# EAGLE design THC-schematicRevES (EAGLE 6.4)
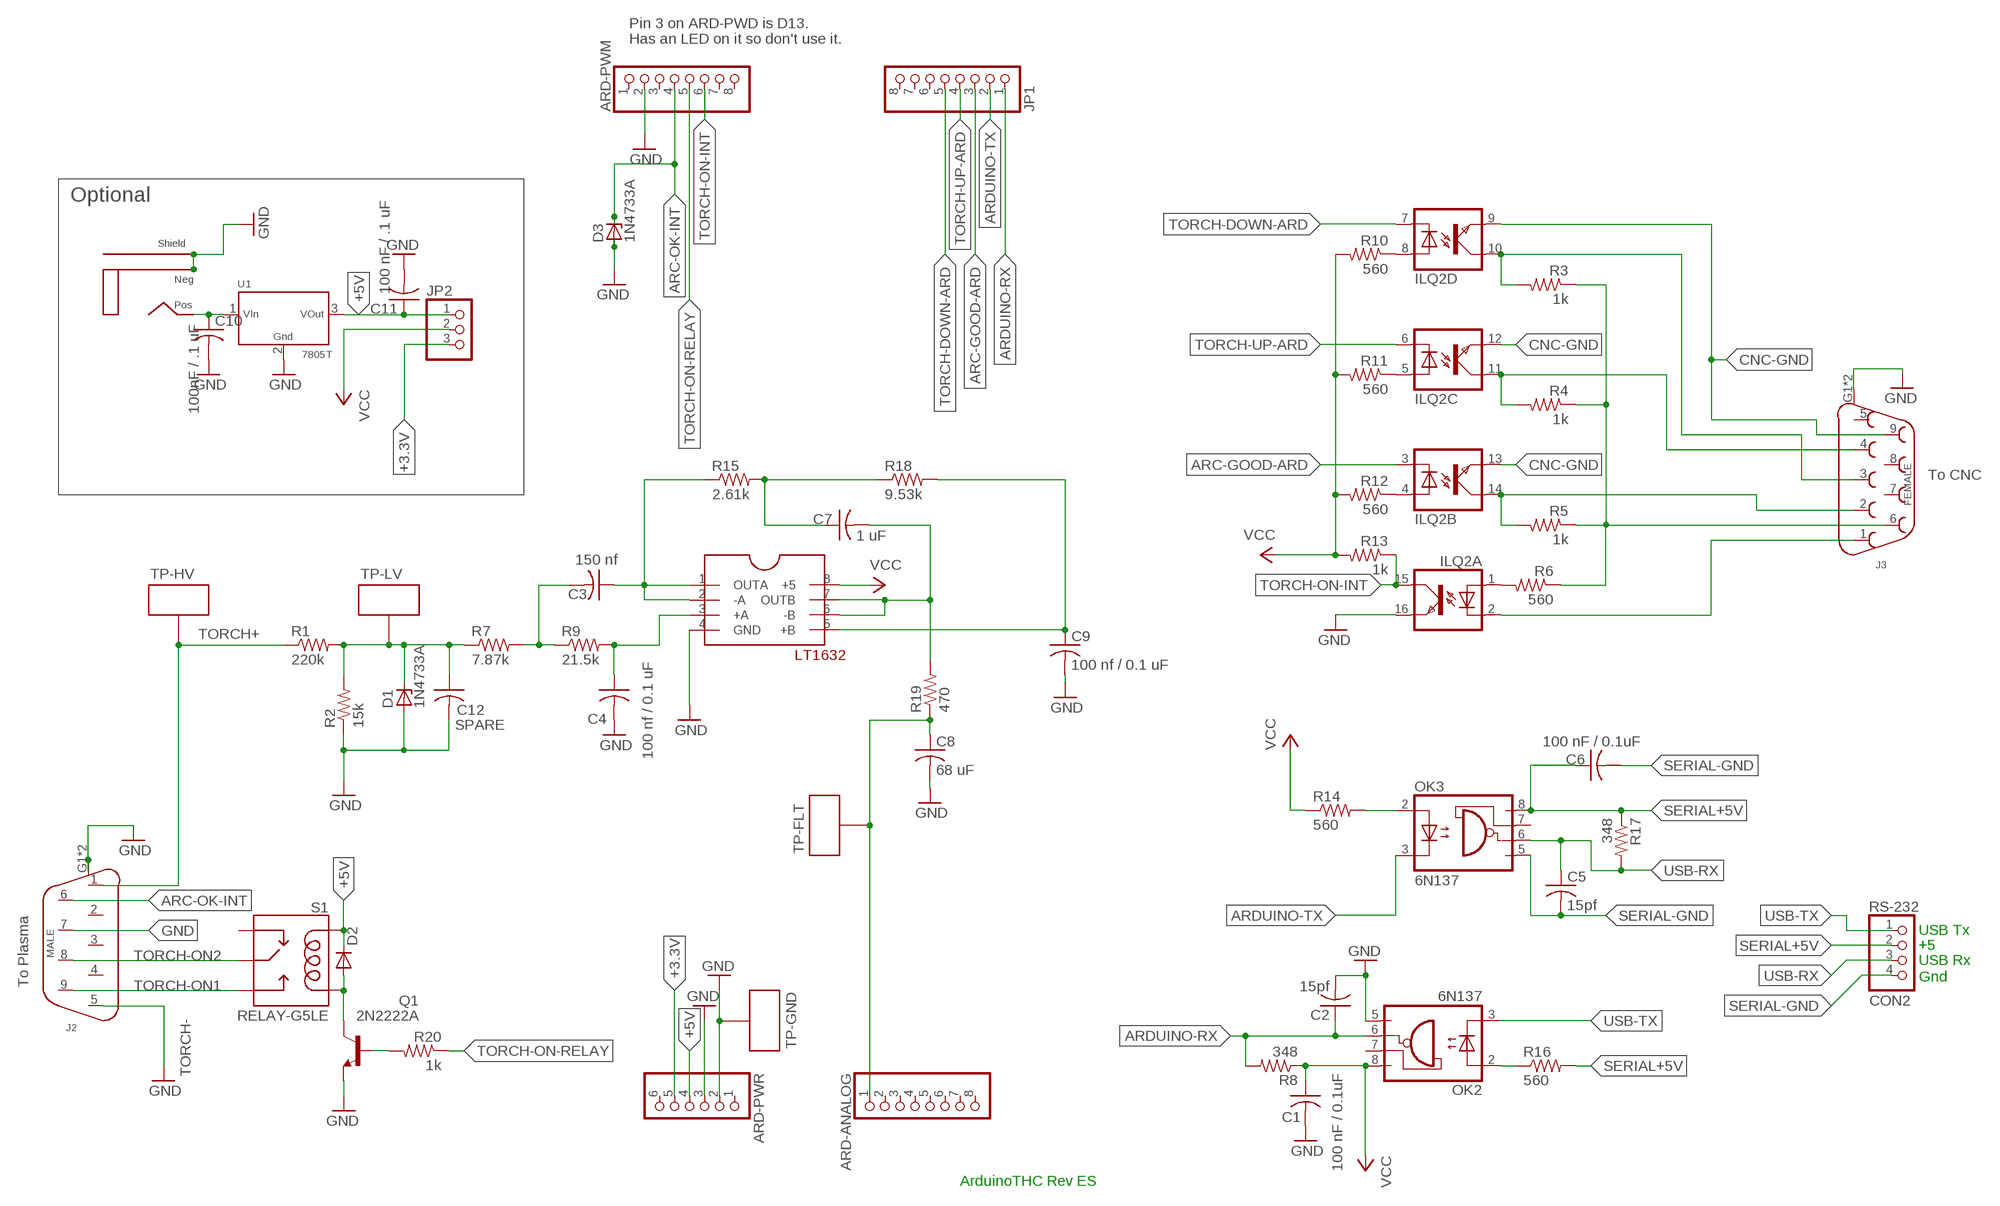
[diagram p0: schematic, sheet 1]

## Parts
ARD-ANALOG  PINHD-1X8  [1X08]
ARD-PWM  PINHD-1X8  [1X08]
ARD-PWR  PINHD-1X6  [1X06]
C1  100 nF / 0.1uF  C-US025-025X050  [C025-025X050]
C2  15pf  C-US025-025X050  [C025-025X050]
C3  150 nf  C-US025-025X050  [C025-025X050]
C4  100 nf / 0.1 uF  C-US025-025X050  [C025-025X050]
C5  15pf  C-US025-025X050  [C025-025X050]
C6  100 nF / 0.1uF  C-US025-025X050  [C025-025X050]
C7  1 uF  C-US025-025X050  [C025-025X050]
C8  68 uF  C-US025-025X050  [C025-025X050]
C9  100 nf / 0.1 uF  C-US025-025X050  [C025-025X050]
C10  100nF / .1 uF  C-US025-025X050  [C025-025X050]
C11  100 nF / .1 uF  C-US025-025X050  [C025-025X050]
C12  SPARE  C-US025-025X050  [C025-025X050]
D1  1N4733A  ZPY  [DO41Z10]
D2  1N4001  [DO-204AL]
D3  1N4733A  ZPY  [DO41Z10]
ILQ2  ILQ1  [DIL16]
J1  2.1MM-PLUG-PCB-MNT  [2.1MM-PLUG]
J2  DB9-MALE  [DB9M-RIGHT-ANGLE]
J3  DB9-FEMALE  [DB9F-RIGHT-ANGLE]
JP1  PINHD-1X8  [1X08]
JP2  PINHD-1X3  [1X03]
OK2  6N137  [DIL08]
OK3  6N137  [DIL08]
Q1  2N2222A  [TO18]
R1  220k  R-US_0207/7  [0207/7]
R2  15k  R-US_0207/7  [0207/7]
R3  1k  R-US_0207/7  [0207/7]
R4  1k  R-US_0207/7  [0207/7]
R5  1k  R-US_0207/7  [0207/7]
R6  560  R-US_0207/7  [0207/7]
R7  7.87k  R-US_0207/7  [0207/7]
R8  348  R-US_0207/7  [0207/7]
R9  21.5k  R-US_0207/7  [0207/7]
R10  560  R-US_0207/7  [0207/7]
R11  560  R-US_0207/7  [0207/7]
R12  560  R-US_0207/7  [0207/7]
R13  1k  R-US_0207/7  [0207/7]
R14  560  R-US_0207/7  [0207/7]
R15  2.61k  R-US_0207/7  [0207/7]
R16  560  R-US_0207/7  [0207/7]
R17  348  R-US_0207/7  [0207/7]
R18  9.53k  R-US_0207/7  [0207/7]
R19  470  R-US_0207/7  [0207/7]
R20  1k  R-US_0207/7  [0207/7]
RS-232  CON2  PINHD-1X4  [1X04]
S1  RELAY-G5LE  [RELAY-G5LE]
TP-FLT  TEST-POINT-.040-HOLE  [TP.040]
TP-GND  TEST-POINT-.040-HOLE  [TP.040]
TP-HV  TEST-POINT-.040-HOLE  [TP.040]
TP-LV  TEST-POINT-.040-HOLE  [TP.040]
U1  7805T  [TO-220-3]
U$1  LT1632  [DIP08]

## Nets
+3.3V: ARD-PWR.5 JP2.3
+5V: ARD-PWR.4 C11.1 D2.C JP2.1 S1.P$5-COIL(COIL-2) U1.3(VOUT)
ARC-GOOD-ARD: ILQ2.3(B:C) JP1.3
ARC-OK-INT: ARD-PWM.4 D3.C J2.6
ARD-ANALOG-IN: ARD-ANALOG.1 C8.1 R19.1 TP-FLT.P$1
ARDUINO-RX: C2.1 JP1.1 OK2.6(VO) R8.2
ARDUINO-TX: JP1.2 OK3.3(C)
CNC+5: J3.6 R3.1 R4.1 R5.1 R6.1
CNC-ARC-GOOD: ILQ2.14(B:COL) J3.2 R5.2
CNC-GND: ILQ2.9(D:EMIT) ILQ2.12(C:EMIT) ILQ2.13(B:EMIT) J3.9
CNC-TORCH-DOWN: ILQ2.10(D:COL) J3.3 R3.2
CNC-TORCH-ON: ILQ2.2(A:C) J3.1
CNC-TORCH-UP: ILQ2.11(C:COL) J3.4 R4.2
DIVIDER: C12.1 D1.C R1.2 R2.2 R7.1 TP-LV.P$1
GND: ARD-PWM.2 ARD-PWR.2 ARD-PWR.3 C1.2 C2.2 C4.2 C8.2 C9.2 C10.2 C11.2 C12.2 D1.A D3.A ILQ2.16(A:EMIT) J1.P$NEG J1.P$SHLD J2.5 J2.7 J2.G1(P$SHLD) J2.G2(P$SHLD) J3.G1(P$SHLD) J3.G2(P$SHLD) OK2.5(GND) Q1.1(E) R2.1 TP-GND.P$1 U1.2(GND) U$1.4(GND)
N$1: C10.1 J1.P$POS U1.1(VIN)
N$2: ILQ2.4(B:A) R12.1
N$3: D2.A Q1.3(C) S1.P$2-COIL(COIL-1)
N$4: Q1.2(B) R20.2
N$7: ILQ2.5(C:A) R11.1
N$8: ILQ2.8(D:A) R10.1
N$9: ILQ2.1(A:A) R6.2
N$26: C3.2 R7.2 R9.1
N$27: C4.1 R9.2 U$1.3(+A)
N$29: C3.1 R15.1 U$1.1(OUTA) U$1.2(-A)
N$30: C7.1 R15.2 R18.1
N$31: C9.1 R18.2 U$1.5(+B)
N$32: OK3.2(A) R14.2
N$34: OK2.2(A) R16.1
SERIAL+5V: C6.1 OK3.8(VCC) R16.2 R17.1 RS-232.2
SERIAL-GND: C5.2 C6.2 OK3.5(GND) RS-232.4
TORCH+: J2.1 R1.1 TP-HV.P$1
TORCH-DOWN-ARD: ILQ2.7(D:C) JP1.5
TORCH-ON1: J2.9 S1.P$4-NO(NO)
TORCH-ON2: J2.8 S1.P$1-COMMON(COM)
TORCH-ON-INT: ARD-PWM.6 ILQ2.15(A:COL) R13.1
TORCH-ON-RELAY: ARD-PWM.5 R20.1
TORCH-UP-ARD: ILQ2.6(C:C) JP1.4
UNFILTERED: C7.2 R19.2 U$1.6(-B) U$1.7(OUTB)
USB-RX: C5.1 OK3.6(VO) R17.2 RS-232.3
USB-TX: OK2.3(C) RS-232.1
VCC: C1.1 JP2.2 OK2.8(VCC) R8.1 R10.2 R11.2 R12.2 R13.2 R14.1 U$1.8(+5)
Unconnected: ARD-ANALOG.2 ARD-ANALOG.3 ARD-ANALOG.4 ARD-ANALOG.5 ARD-ANALOG.6 ARD-ANALOG.7 ARD-ANALOG.8 ARD-PWM.1 ARD-PWM.3 ARD-PWM.7 ARD-PWM.8 ARD-PWR.1 ARD-PWR.6 J2.2 J2.3 J2.4 J3.5 J3.7 J3.8 JP1.6 JP1.7 JP1.8 OK2.7(VE) OK3.7(VE) S1.P$3-NC(NC)

## Notes on the sheet
- Pin 3 on ARD-PWD is D13.
  Has an LED on it so don't use it.
- Optional
- To CNC
- TORCH+
- To Plasma
- USB Tx
- +5
- USB Rx
- Gnd
- TORCH-
- ArduinoTHC Rev ES

## Library data of the parts
ARD-ANALOG ARD-PWM JP1 = pinhead:PINHD-1X8: PIN HEADER
ARD-PWR = pinhead:PINHD-1X6: PIN HEADER
C1-C12 = resistor:C-US: CAPACITOR, American symbol
D1 D3 = diode:ZPY: Z DIODE 1 W
D2 = DIODE-1N4001:1N4001
ILQ2 = optocoupler:ILQ1: SIEMENS OPTO COUPLER; MF: VISHAY/TELEFUNKEN; MPN: ILQ1; OC_FARNELL: 1469501; OC_NEWARK: 88K1954
J1 = ArdunioPowerJack:2.1MM-PLUG-PCB-MNT
J2 = DB-9Male-Rangle-RMG:DB9-MALE
J3 = DB-9Male-Rangle-RMG:DB9-FEMALE
JP2 = pinhead:PINHD-1X3: PIN HEADER
OK2 OK3 = optocoupler:6N137: MOTOROLA OPTO COUPLER; MPN: 6N137; OC_FARNELL: 1328376; OC_NEWARK: 52M1895
Q1 = transistor-npn:2N2222*: NPN Transistor
R1-R20 = resistor:R-US_: RESISTOR, American symbol
RS-232 = pinhead:PINHD-1X4: PIN HEADER
S1 = RELAY-G5LE:RELAY-G5LE
TP-FLT TP-GND TP-HV TP-LV = TestPoint:TEST-POINT-.040-HOLE
U1 = 7805Regulator-RMG:7805T
U$1 = ArduinoThcOpAmp:LT1632

## Board
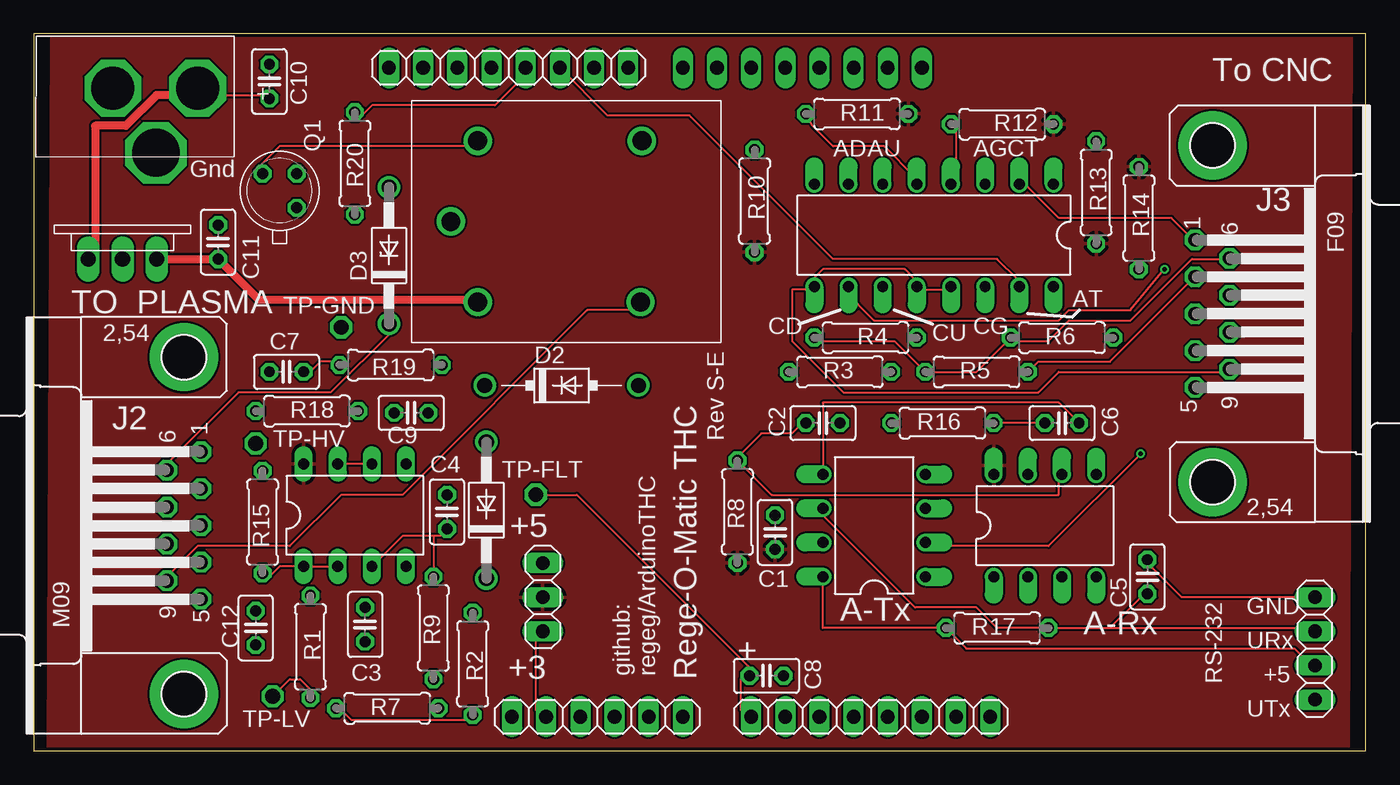
[diagram p1: board, top side]
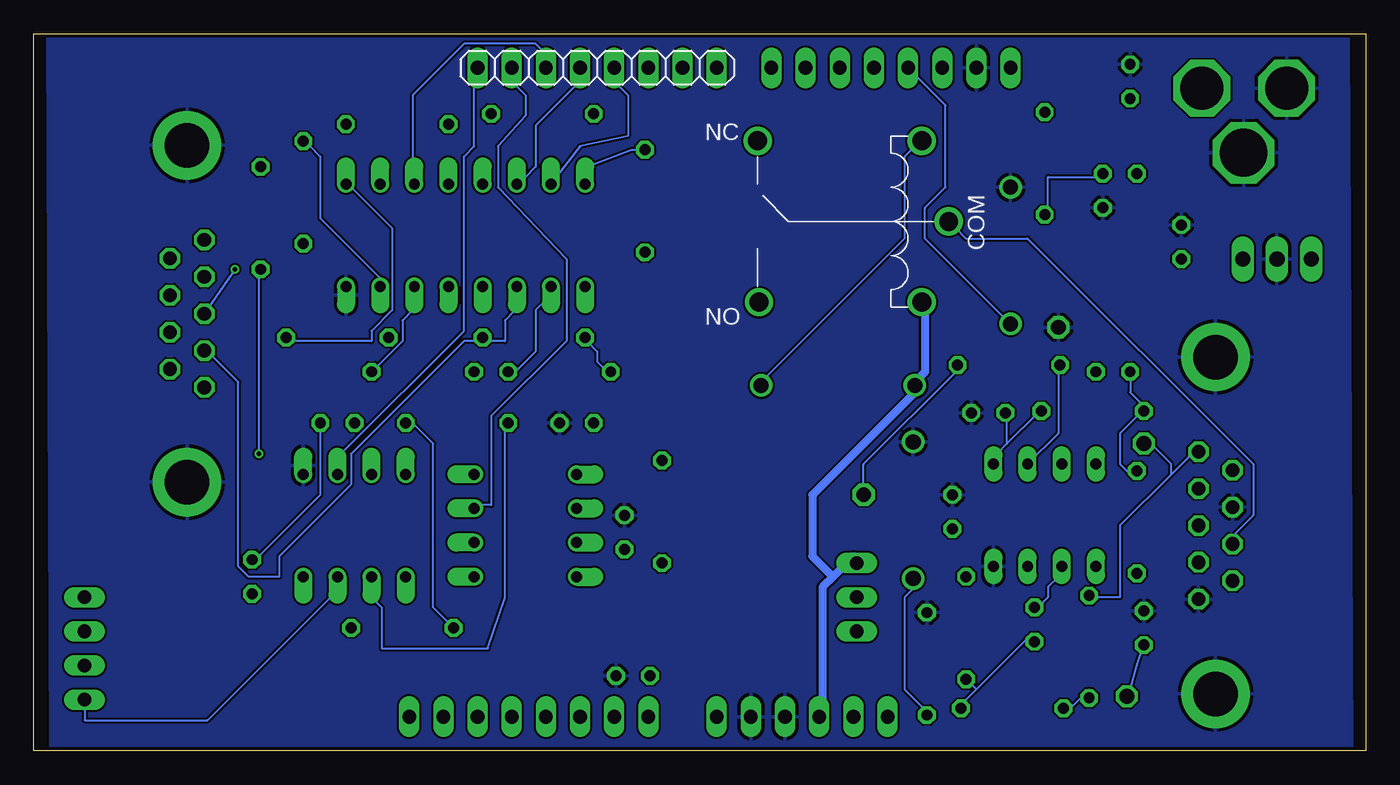
[diagram p2: board, bottom side, seen from below]

Size 99.04 x 53.34 mm. Coordinates in mm from the lower left corner, seen from the top.
Outline: 0,0 99.04,0 99.04,53.34 0,53.34 0,0
Copper layers (1*16): Top 0.035mm / dielectric 1.5mm / Bottom 0.035mm
Design rules "Seeed Studio - Fusion_eagle_rule_v1.1": minimum track width 6mil, minimum drill 12mil, track to track 6mil, track to pad 6mil, pad to pad 6mil, via to via 6mil, smd to smd 0mil, copper to edge 10mil, drill to drill 10mil, minimum pad ring 10mil, minimum via ring 6mil, stop-mask expansion 2mil, vias tented up to drill 100mil, thermal gap 10mil

### Footprints (pad centres in the part's own frame; a part is rotated, then mirrored left to right if it is on the bottom)
1X08 = drill 1.016 long: 1 -8.89,0; 2 -6.35,0; 3 -3.81,0; 4 -1.27,0; 5 1.27,0; 6 3.81,0; 7 6.35,0; 8 8.89,0
1X06 = drill 1.016 long: 1 -6.35,0; 2 -3.81,0; 3 -1.27,0; 4 1.27,0; 5 3.81,0; 6 6.35,0
C025-025X050 = drill 0.813 octagon: 1 -1.27,0; 2 1.27,0
DO41Z10 = drill 1.118: A 5.08,0; C -5.08,0
DO-204AL = drill 1.118: A 5.08,0; C -6.35,0
DIL16 = drill 0.813 offset: 1 -8.89,-3.81; 2 -6.35,-3.81; 3 -3.81,-3.81; 4 -1.27,-3.81; 5 1.27,-3.81; 6 3.81,-3.81; 7 6.35,-3.81; 8 8.89,-3.81; 9 8.89,3.81; 10 6.35,3.81; 11 3.81,3.81; 12 1.27,3.81; 13 -1.27,3.81; 14 -3.81,3.81; 15 -6.35,3.81; 16 -8.89,3.81
2.1MM-PLUG = drill 3.2 octagon: P$NEG -6.3,0; P$POS 0,0 | drill 3.556 octagon: P$SHLD -3.1,-4.8
DB9M-RIGHT-ANGLE = drill 1.016 octagon: 1 5.486,-1.27; 2 2.743,-1.27; 3 0,-1.27; 4 -2.743,-1.27; 5 -5.486,-1.27; 6 4.115,1.27; 7 1.372,1.27; 8 -1.372,1.27; 9 -4.115,1.27 | drill 3.302 pad 5.08: G1 -12.522,0; G2 12.522,0
DB9F-RIGHT-ANGLE = drill 1.016 octagon: 1 -5.486,-10.16; 2 -2.743,-10.16; 3 0,-10.16; 4 2.743,-10.16; 5 5.486,-10.16; 6 -4.115,-7.62; 7 -1.372,-7.62; 8 1.372,-7.62; 9 4.115,-7.62 | drill 3.302 pad 5.08: G1 -12.522,-8.89; G2 12.522,-8.89
1X03 = drill 1.016 long: 1 -2.54,0; 2 0,0; 3 2.54,0
DIL08 = drill 0.813 offset: 1 -3.81,-3.81; 2 -1.27,-3.81; 3 1.27,-3.81; 4 3.81,-3.81; 5 3.81,3.81; 6 1.27,3.81; 7 -1.27,3.81; 8 -3.81,3.81
TO18 = drill 0.813 octagon: 1 -1.27,-1.27; 2 1.27,-1.27; 3 1.27,1.27
0207/7 = drill 0.813 octagon: 1 -3.81,0; 2 3.81,0
1X04 = drill 1.016 long: 1 -3.81,0; 2 -1.27,0; 3 1.27,0; 4 3.81,0
RELAY-G5LE = drill 1.4: P$1-COMMON -8.1,0; P$2-COIL -6.1,6; P$3-NC 6.1,6; P$4-NO 6,-6; P$5-COIL -6.1,-6
TP.040 = drill 1.1 octagon: P$1 0,0
TO-220-3 = drill 1.118 long: 1 -2.54,0; 2 0,0; 3 2.54,0
DIP08 = drill 0.813 long: 1 -2.54,-3.81; 2 0,-3.81; 3 2.54,-3.81; 4 5.08,-3.81; 5 5.08,3.81; 6 2.54,3.81; 7 0,3.81; 8 -2.54,3.81

### Placement (x,y rotation side)
ARD-ANALOG  62.23,2.54 0 top
ARD-PWM  35.31,50.8 0 top
ARD-PWR  41.91,2.54 180 top
C1  55.12,16.26 90 top
C2  58.67,24.38 0 top
C3  24.64,9.4 270 top
C4  30.73,17.78 90 top
C5  82.8,12.95 90 top
C6  76.45,24.38 0 top
C7  18.8,28.19 0 top
C8  54.48,5.59 0 top
C9  28.07,25.15 0 top
C10  17.53,49.78 90 top
C11  13.72,37.85 90 top
C12  16.51,9.14 90 top
D1  33.66,17.91 90 top
D2  39.88,27.18 0 top
D3  26.42,36.83 90 top
ILQ2  66.93,38.35 180 top
J1  12.19,49.28 0 top
J2  11.18,16.76 90 top
J3  96.52,32.51 270 top
JP1  57.15,50.8 0 bottom
JP2  37.85,11.43 270 top
OK2  75.18,16.76 0 top
OK3  62.48,16.76 90 top
Q1  18.29,41.66 90 top
R1  20.57,7.75 270 top
R2  32.64,6.48 270 top
R3  59.94,28.19 0 top
R4  61.85,30.73 0 top
R5  70.1,28.19 0 top
R6  76.45,30.73 0 top
R7  26.29,3.17 0 top
R8  52.32,17.78 90 top
R9  29.72,9.14 90 top
R10  53.59,40.89 270 top
R11  61.21,47.37 0 top
R12  72.01,46.61 0 top
R13  78.99,41.53 270 top
R14  82.17,39.62 270 top
R15  17.02,17.02 90 top
R16  67.56,24.38 0 top
R17  71.63,9.14 0 top
R18  20.32,25.27 0 top
R19  26.54,28.7 180 top
R20  23.88,43.69 270 top
RS-232  95.25,7.62 90 top
S1  39.12,39.37 0 top
TP-FLT  37.34,19.05 0 top
TP-GND  22.86,31.5 0 top
TP-HV  16.51,22.86 0 top
TP-LV  17.78,4.06 0 top
U1  6.6,36.58 0 top
U$1  22.61,17.53 0 top

### Tracks (layer width: path | path; a pad name or v marks a point on that pad's centre or on a via)
+3.3V
  Top 0.152: JP2.3 37.34,8.38 37.34,3.05 38.1,3.05 ARD-PWR.5
+5V
  Top 0.152: 32.77,33.53 S1.P$5-COIL
  Top 0.61: U1.3 C11.1 16.76,33.53 32.77,33.53
  Bottom 0.152: 40.39,3.05 ARD-PWR.4 | 38.1,14.48 JP2.1 | 33.53,27.43 D2.C 33.53,26.67 | 32.77,32.77 S1.P$5-COIL
  Bottom 0.61: 40.39,3.05 40.39,12.19 39.62,12.95 | 38.1,14.48 39.62,12.95 | 33.53,27.43 32.77,28.19 32.77,32.77 | 39.62,12.95 41.15,14.48 41.15,19.05 33.53,26.67
ARC-GOOD-ARD
  Bottom 0.152: JP1.3 60.96,51.82 61.72,52.58 67.06,52.58 70.87,48.77 70.87,42.67 ILQ2.3
ARC-OK-INT
  Top 0.152: J2.6 9.91,21.34 15.24,26.67 22.1,26.67 26.67,31.24 D3.C
  Bottom 0.152: ARD-PWM.4 31.24,48.01 31.24,41.91 32.77,40.39 32.77,38.1 D3.C
ARD-ANALOG-IN
  Top 0.152: ARD-ANALOG.1 53.34,3.05 52.58,3.05 52.58,5.33 C8.1 53.34,6.1 40.39,19.05 TP-FLT.P$1
  Bottom 0.152: TP-FLT.P$1 37.34,21.34 30.48,28.19 R19.1
ARDUINO-RX
  Top 0.152: C2.1 57.15,24.38 56.39,23.62 54.1,23.62 52.58,22.1 R8.2 54.86,19.05 76.2,19.05 76.2,20.57 OK2.6
  Bottom 0.152: JP1.1 66.29,50.29 66.29,44.96 67.06,44.2 67.06,31.24 76.2,22.1 76.2,20.57 OK2.6
ARDUINO-TX
  Bottom 0.152: OK3.3 66.29,18.29 65.02,18.29 65.02,24.89 59.44,30.48 59.44,36.58 64.52,41.91 64.52,44.96 62.48,47.24 62.48,48.77 63.25,49.53 63.25,50.29 JP1.2
CNC+5
  Top 0.152: R4.1 58.67,30.48 64.01,30.48 R5.1 70.1,28.19 R6.1 73.15,30.48 75.44,30.48 76.96,32 81.53,32 86.11,36.58 88.39,36.58 J3.6
  Bottom 0.152: R3.1 56.39,28.19 57.15,28.96 57.15,29.72 57.91,30.48 R4.1
CNC-ARC-GOOD
  Top 0.152: R5.2 74.68,28.96 80.01,28.96 86.11,35.05 J3.2
  Bottom 0.152: R5.2 71.63,30.48 71.63,32 70.87,32.77 70.87,34.29 ILQ2.14
CNC-GND
  Top 0.152: ILQ2.13 67.82,34.29 66.29,34.29 ILQ2.12 65.53,35.05 64.77,35.81 58.67,35.81 57.91,35.05 ILQ2.9 57.91,34.29 56.39,34.29 56.39,30.48 60.2,26.67 74.68,26.67 76.2,28.19 88.39,28.19 J3.9
CNC-TORCH-DOWN  (via drill 0.3)
  Top 0.152: v84.07,35.81 81.53,32.77 76.96,32.77 76.2,32 62.48,32 60.2,34.29 ILQ2.10
  Bottom 0.152: R3.2 63.25,28.19 61.72,29.72 61.72,32.77 60.96,33.53 60.96,34.29 ILQ2.10 | v84.07,35.81 J3.3
CNC-TORCH-ON
  Top 0.152: ILQ2.2 73.91,41.91 76.2,39.62 84.58,39.62 86.11,38.1 J3.1
CNC-TORCH-UP
  Bottom 0.152: ILQ2.11 63.25,34.29 63.25,32.77 64.01,32 64.01,30.48 65.53,30.48 R4.2 66.29,30.48 67.06,30.48 75.44,22.1 75.44,19.81 80.77,14.48 80.77,12.95 83.06,12.95 83.82,13.72 83.82,27.43 86.11,29.72 J3.4
DIVIDER
  Top 0.152: TP-LV.P$1 19.05,5.33 19.81,5.33 20.57,4.57 R1.2 | R7.1 22.86,3.05 23.62,2.29 32.77,2.29 R2.2
  Bottom 0.152: R1.2 20.57,4.57 22.1,3.05 R7.1 | C12.1 17.02,6.35 17.53,4.57 TP-LV.P$1 | R2.2 32.77,3.05 34.29,4.57 34.29,11.43 33.53,12.19 D1.C
GND
  pour Bottom: 1.27,53.34 1.02,0 97.79,0 98.04,53.34
N$1
  Top 0.152: C10.1 17.53,48.77 12.19,48.77 J1.P$POS | 4.57,36.58 U1.1
  Top 0.61: 4.57,36.58 4.57,46.48 6.86,46.48 9.14,48.77 12.19,48.77
N$2
  Top 0.152: ILQ2.4 68.58,42.67 68.58,46.48 R12.1
N$3
  Top 0.152: Q1.3 16.76,43.43 18.29,44.96 32.77,44.96 S1.P$2-COIL
  Bottom 0.152: D2.A 44.96,27.43 34.29,38.1 34.29,44.2 33.53,44.96 S1.P$2-COIL
N$4
  Bottom 0.152: Q1.2 19.81,42.67 23.62,42.67 23.62,40.39 R20.2
N$7
  Top 0.152: R11.1 57.91,46.48 59.44,44.96 63.25,44.96 65.53,42.67 ILQ2.5
N$8
  Bottom 0.152: R10.1 54.61,44.7 57.91,43.43 57.91,41.91 ILQ2.8
N$9
  Bottom 0.152: R6.2 80.01,30.48 73.91,30.48 73.91,31.24 72.39,32.77 72.39,38.86 75.44,41.91 ILQ2.1
N$26
  Bottom 0.152: 28.96,4.57 29.72,3.81 29.72,3.05 R7.2 | 28.96,4.57 25.15,8.38 C3.2 | 28.96,4.57 R9.1
N$27
  Top 0.152: U$1.3 27.43,16 29.72,16 | 29.72,16 30.48,16 C4.1 | 29.72,16 R9.2
N$29
  Top 0.152: R15.1 17.53,12.95 18.29,13.72 U$1.1 U$1.2
  Bottom 0.152: C3.1 24.38,10.67 23.62,11.43 23.62,12.19 22.86,12.95 22.86,13.72 U$1.2
N$30
  Bottom 0.152: C7.1 17.53,26.67 16.76,25.91 R18.1 16.76,25.15 18.29,23.62 18.29,21.34 17.53,20.57 R15.2
N$31
  Bottom 0.152: 26.67,22.86 26.67,25.15 C9.1 | 26.67,22.86 27.43,22.1 27.43,21.34 U$1.5 | 26.67,22.86 24.38,25.15 R18.2
N$32  (via drill 0.3)
  Top 0.152: v82.3,22.1 75.44,15.24 66.29,15.24 OK3.2
  Bottom 0.152: v82.3,22.1 82.3,35.81 R14.2
N$34
  Bottom 0.152: OK2.2 73.91,11.43 73.15,10.67 73.15,7.62 65.28,7.62 64.01,11.43 64.01,24.38 R16.1
SERIAL+5V
  Top 0.152: C6.1 R16.2 | OK3.8 58.67,9.14 R17.1 69.34,7.62 93.73,7.62 94.49,6.86 95.25,6.86 RS-232.2
  Bottom 0.152: R17.1 69.34,10.67 69.34,22.86 70.87,24.38 R16.2
SERIAL-GND
  Top 0.152: RS-232.4 85.34,11.43 83.06,13.72 C5.2 | OK3.5 58.67,25.91 76.2,25.91 C6.2
  Bottom 0.152: C6.2 77.72,19.05 82.3,14.48 C5.2
TORCH+
  Bottom 0.152: 14.48,20.57 12.95,22.1 J2.1 | 14.48,20.57 18.29,16.76 18.29,11.43 20.57,11.43 R1.1 | 14.48,20.57 14.48,21.34 16,22.86 TP-HV.P$1
TORCH-DOWN-ARD
  Bottom 0.152: ILQ2.7 60.2,42.67 58.42,44.96 54.86,45.72 54.86,48.77 55.63,49.53 55.63,50.29 JP1.5
TORCH-ON1
  Top 0.152: J2.9 9.91,12.95 12.19,15.24 19.05,15.24 22.86,19.05 27.43,19.05 41.15,32.77 44.96,32.77 S1.P$4-NO
TORCH-ON2
  Bottom 0.152: J2.8 9.91,16 8.38,17.53 8.38,21.34 25.15,38.1 29.72,38.1 30.48,38.86 S1.P$1-COMMON
TORCH-ON-INT
  Top 0.152: ARD-PWM.6 42.67,47.24 48.77,47.24 59.44,36.58 71.63,36.58 73.15,35.05 ILQ2.15
  Bottom 0.152: ILQ2.15 73.15,35.05 77.72,39.62 77.72,44.2 78.49,44.96 R13.1
TORCH-ON-RELAY
  Top 0.152: R20.1 24.38,47.24 25.15,48.01 34.29,48.01 36.58,50.29 ARD-PWM.5
TORCH-UP-ARD
  Bottom 0.152: ILQ2.6 62.48,42.67 61.72,43.43 61.72,46.48 58.67,49.53 58.67,50.29 JP1.4
UNFILTERED
  Top 0.152: U$1.6 U$1.7 | C7.2 20.57,28.19 21.34,28.96 22.1,28.96 R19.2
  Bottom 0.152: U$1.6 22.86,23.62 22.86,28.19 R19.2
USB-RX
  Top 0.152: OK3.6 58.67,17.53 65.53,10.67 70.1,10.67 71.63,9.14 R17.2 80.01,9.14 | 80.01,9.14 82.3,11.43 C5.1 | 80.01,9.14 95.25,9.14 RS-232.3
USB-TX
  Bottom 0.152: RS-232.1 95.25,2.29 86.11,2.29 76.96,11.43 76.96,12.95 OK2.3
VCC
  pour Top: 1.27,53.34 1.02,0 97.79,0 98.04,53.34

### Text on the board
tPlace: To CNC | AD | AU | AG | CT | AT | CD | CG | Rev S-E | CU | +5 | A-Tx | A-Rx | GND | URx | +3 | + | github: / regeg/ArduinoTHC | Rege-O-Matic THC | +5 | UTx
tNames: TO PLASMA
tValues: +